# EasyEDA Pro project 01_立创eda专业版_esp32语音助手-自制版_2024-07-09.epro, schematic Schematic2
Create Date: 2024-06-22; Page Name: esp32_mini; Project Name: esp32语音助手-自制版; Schematic Name: Schematic2; Update Date: 2024-06-22; Company: 嘉立创EDA; Page Size: A4; Version: V1.0
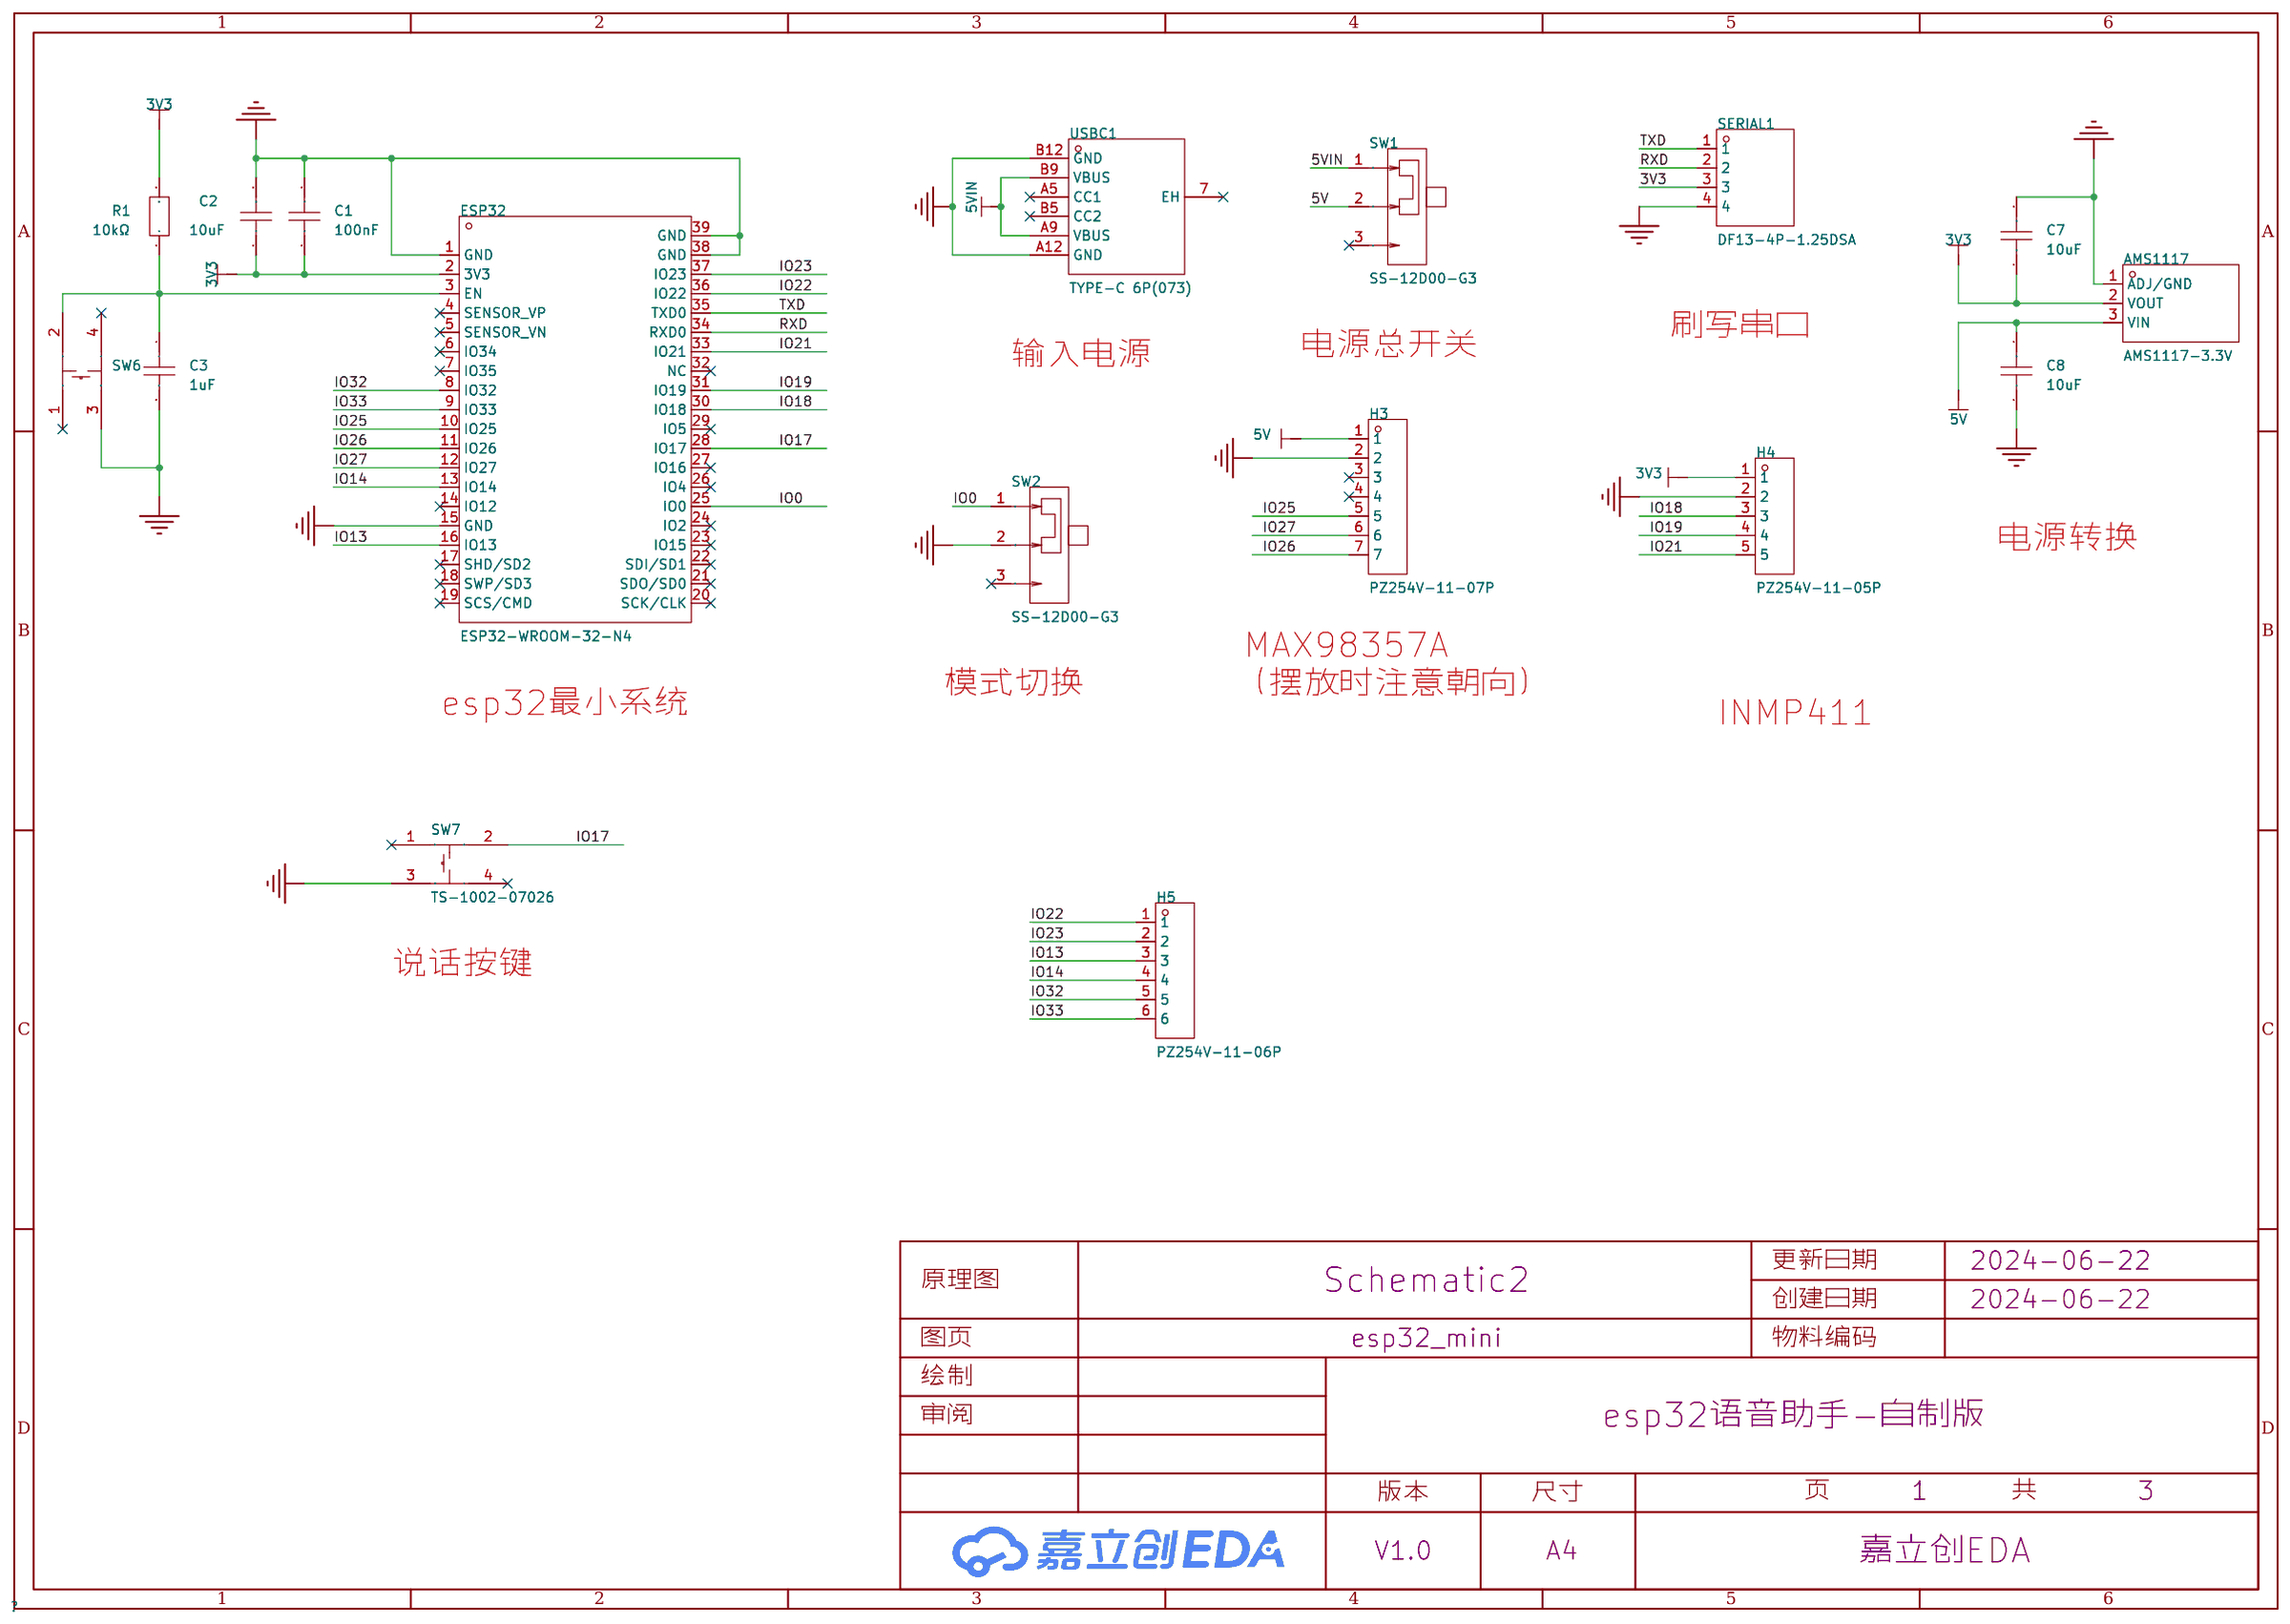
[diagram p9: schematic sheet]

## Parts
AMS1117  AMS1117-3.3V  [SOT-89-3_L4.5-W2.5-P1.50-LS4.2-BR]
C1  100nF  [C0603]
C2  10uF  [C0603]
C3  1uF  [C0603]
C7  10uF  [C0603]
C8  10uF  [C0603]
ESP32  ESP32-WROOM-32-N4  [WIFIM-SMD_ESP32-WROOM-32-N4]
H3  PZ254V-11-07P  [HDR-TH_7P-P2.54-V-M]
H4  PZ254V-11-05P  [HDR-TH_5P-P2.54-V-M]
H5  PZ254V-11-06P  [HDR-TH_6P-P2.54-V-M]
R1  10kΩ  [R0603]
SERIAL1  DF13-4P-1.25DSA  [CONN-TH_DF13-4P-1.25DSA]
SW1  SS-12D00-G3  [SW-TH_SS-12D00-G3]
SW2  SS-12D00-G3  [SW-TH_SS-12D00-G3]
SW6  TS-1002-07026  [SW-TH_4P-L6.0-W6.0-P4.50-LS6.5]
SW7  TS-1002-07026  [SW-TH_4P-L6.0-W6.0-P4.50-LS6.5]
USBC1  TYPE-C 6P(073)  [TYPE-C-SMD_TYPE-C-6P]

## Library data of the parts
AMS1117 = AMS1117-3.3V_C5120796: 输出类型:固定;最大输入电压:18V;输出电压:3.3V;最大输出电流:1A;输出极性:正极;; LCSC Part Name: 输入18V 输出3.3V 1A; Supplier Part: C5120796; Manufacturer: MSKSEMI(美森科); Supplier Footprint: SOT-89; JLCPCB Part Class: 扩展库; Datasheet: https://atta.szlcsc.com/upload/public/pdf/source/20231123/6117526697EB8BF6175FDEEBA0877266.pdf; Supplier: LCSC; Output Type: 固定; Maximum Input Voltage: 18V; Output Voltage: 3.3V; MAX Output Current: 1A; Dropout Voltage: 1.4V@(1A); standby current: 12mA; Operating Temperature: 0℃~+125℃; Output Polarity: 正极; Number of Outputs: 1
C1 = CC0603KRX7R9BB104: 容值:100nF;精度:±10%;额定电压:50V;材质(温度系数):X7R;; LCSC Part Name: 100nF ±10% 50V; Supplier Part: C14663; Manufacturer: YAGEO(国巨); Supplier Footprint: 0603; JLCPCB Part Class: 基础库; Datasheet: https://atta.szlcsc.com/upload/public/pdf/source/20180910/C282072_33301C7F631E79921B82A8DAC6BCC5B3.pdf; Supplier: LCSC; Tolerance: ±10%; Voltage Rated: 50V; Temperature Coefficient: X7R
C2 = CL10A106MA8NRNC: 容值:10uF;精度:±20%;额定电压:25V;材质(温度系数):X5R;; LCSC Part Name: 10uF ±20% 25V; Supplier Part: C96446; Manufacturer: SAMSUNG(三星); Supplier Footprint: 0603; JLCPCB Part Class: 基础库; Datasheet: https://atta.szlcsc.com/upload/public/pdf/source/20160218/1457707763339.pdf; Supplier: LCSC; Tolerance: ±20%; Voltage Rated: 25V; Temperature Coefficient: X5R
C3 = CL10A105KB8NNNC: 容值:1uF;精度:±10%;额定电压:50V;材质(温度系数):X5R;; LCSC Part Name: 1uF ±10% 50V; Supplier Part: C15849; Manufacturer: SAMSUNG(三星); Supplier Footprint: 0603; JLCPCB Part Class: 基础库; Datasheet: https://atta.szlcsc.com/upload/public/pdf/source/20160218/1457707763339.pdf; Supplier: LCSC; Tolerance: ±10%; Voltage Rated: 50V; Temperature Coefficient: X5R
C7 C8 = CL10A106KP8NNNC: 容值:10uF;精度:±10%;额定电压:10V;材质(温度系数):X5R;; LCSC Part Name: 10uF ±10% 10V; Supplier Part: C19702; Manufacturer: SAMSUNG(三星); Supplier Footprint: 0603; JLCPCB Part Class: 基础库; Datasheet: https://atta.szlcsc.com/upload/public/pdf/source/20160218/1457707763339.pdf; Supplier: LCSC; Tolerance: ±10%; Voltage Rated: 10V; Temperature Coefficient: X5R
ESP32 = ESP32-WROOM-32-N4: WiFi+蓝牙4.2+双核CPU,ESP32; LCSC Part Name: WiFi+蓝牙4.2+双核CPU模块; Supplier Part: C82899; Manufacturer: ESPRESSIF(乐鑫); Supplier Footprint: SMD,18x25.5mm; JLCPCB Part Class: 扩展库; Datasheet: https://atta.szlcsc.com/upload/public/pdf/source/20210719/C82899_2D52724B6FAFABC419BCF308C5944296.pdf; Supplier: LCSC
H3 = PZ254V-11-07P: 插针结构:1x7P;间距:2.54mm;行距:-;圆针/方针:方针;安装类型:直插;排数:单排;总PIN位数:7P;额定电流:-;额定电压:-;配合针长度:6mm;塑高:2.5mm;端接针长度:3mm;触头材质:黄铜;触头镀层:-;工作温度范围:-40℃~+105℃;颜色:黑色;; LCSC Part Name: 间距:2.54mm 1x7P 直插 方针; Supplier Part: C492406; Manufacturer: XFCN(兴飞); Supplier Footprint: 插件,P=2.54mm; JLCPCB Part Class: 扩展库; Datasheet: https://atta.szlcsc.com/upload/public/pdf/source/20200309/C492406_654C533EE691117E22DD9F76C114C2D9.pdf; Supplier: LCSC; Pin Structure: 1x7P; Pitch: 2.54mm; Circluar Pins/Square Pins: 方针; Mounting Type: 直插; Number of Rows: 单排; Number of Pins: 7P; Length of Mating Pin: 6mm; Insulation Height: 2.5mm; Length of End Connection Pin: 3mm; Contact Material: 黄铜; Operating Temperature Range: -40℃~+105℃; Color: 黑色
H4 = PZ254V-11-05P: 插针结构:1x5P;间距:2.54mm;行距:-;圆针/方针:方针;安装类型:直插;排数:单排;总PIN位数:5P;额定电流:-;额定电压:-;配合针长度:6mm;塑高:2.5mm;端接针长度:3mm;触头材质:黄铜;触头镀层:-;工作温度范围:-40℃~+105℃;颜色:黑色;; LCSC Part Name: 间距:2.54mm 1x5P 直插 方针; Supplier Part: C492404; Manufacturer: XFCN(兴飞); Supplier Footprint: 插件,P=2.54mm; JLCPCB Part Class: 扩展库; Datasheet: https://atta.szlcsc.com/upload/public/pdf/source/20200309/C492404_E51533260F8710EFF5D4617281164C1D.pdf; Supplier: LCSC; Pin Structure: 1x5P; Pitch: 2.54mm; Circluar Pins/Square Pins: 方针; Mounting Type: 直插; Number of Rows: 单排; Number of Pins: 5P; Length of Mating Pin: 6mm; Insulation Height: 2.5mm; Length of End Connection Pin: 3mm; Contact Material: 黄铜; Operating Temperature Range: -40℃~+105℃; Color: 黑色
H5 = PZ254V-11-06P: 插针结构:1x6P;间距:2.54mm;行距:-;圆针/方针:方针;安装类型:直插;排数:单排;总PIN位数:6P;额定电流:-;额定电压:-;配合针长度:6mm;塑高:2.5mm;端接针长度:3mm;触头材质:黄铜;触头镀层:-;工作温度范围:-40℃~+105℃;颜色:黑色;; LCSC Part Name: 间距:2.54mm 1x6P 直插 方针; Supplier Part: C492405; Manufacturer: XFCN(兴飞); Supplier Footprint: 插件,P=2.54mm; JLCPCB Part Class: 扩展库; Datasheet: https://atta.szlcsc.com/upload/public/pdf/source/20200309/C492405_597F1930F5B55CC3C7FD95458F1C3977.pdf; Supplier: LCSC; Pin Structure: 1x6P; Pitch: 2.54mm; Circluar Pins/Square Pins: 方针; Mounting Type: 直插; Number of Rows: 单排; Number of Pins: 6P; Length of Mating Pin: 6mm; Insulation Height: 2.5mm; Length of End Connection Pin: 3mm; Contact Material: 黄铜; Operating Temperature Range: -40℃~+105℃; Color: 黑色
R1 = FRC0603J103TS: 电阻类型:厚膜电阻;阻值:10kΩ;精度:±5%;功率:100mW;最大工作电压:75V;温度系数:±100ppm/℃;; LCSC Part Name: 10kΩ ±5% 100mW 厚膜电阻; Supplier Part: C2930027; Manufacturer: FOJAN(富捷); Supplier Footprint: 0603; JLCPCB Part Class: 扩展库; Datasheet: https://atta.szlcsc.com/upload/public/pdf/source/20211221/925EC7D7225764EE0046F22065062C87.pdf; Supplier: LCSC; Type: 厚膜电阻; Tolerance: ±5%; Power(Watts): 100mW; Overload Voltage (Max): 75V; Temperature Coefficient: ±100ppm/℃; Operating Temperature Range: -55℃~+155℃
SERIAL1 = DF13-4P-1.25DSA: 插针结构:1x4P;间距:1.25mm;安装方式:-;参考系列:-;总PIN数:4P;排数:1;每排PIN数:4;行距:-;触头材质:黄铜;; LCSC Part Name: 间距:1.25mm 1x4P; Supplier Part: C202091; Manufacturer: HRS(广濑); Supplier Footprint: P=1.25mm; JLCPCB Part Class: 扩展库; Datasheet: https://atta.szlcsc.com/upload/public/pdf/source/20180509/C202091_DB48A71B72F23293CB2FD82E8A62B156.pdf; Supplier: LCSC; Pins Structure: 1x4P; Pitch: 1.25mm; Number of Pins: 4P; Number of Rows: 1; Number of PINs Per Row: 4; Contact Material: 黄铜
SW1 SW2 = SS-12D00-G3: Supplier Part: C22355741; Manufacturer: SOFNG(硕方); Supplier Footprint: 插件-3P,8.8x3.9mm; Datasheet: https://atta.szlcsc.com/upload/public/pdf/source/20240529/1037A069FE9BBCECE56007AB916D4384.pdf; Supplier: LCSC
SW6 SW7 = TS-1002-07026: 电路结构:单刀单掷;按钮形状:圆形按钮;安装方式:直插;开关长度:6mm;开关宽度:6mm;开关高度:7mm;触点电流:50mA;额定电压(DC):12V;带灯:-;机械寿命:-;; LCSC Part Name: 6*6*7mm 直插 轻触开关; Supplier Part: C455095; Manufacturer: XUNPU(讯普); Supplier Footprint: 插件,6x6mm; JLCPCB Part Class: 扩展库; Datasheet: https://atta.szlcsc.com/upload/public/pdf/source/20231108/52BC6409AB52B6746CCC051A15664904.pdf; Supplier: LCSC; Circuit: 单刀单掷; Actuator Style: 圆形按钮; Mounting Style: 直插; Switch Length: 6mm; Switch Width: 6mm; Switch Height: 7mm; Contact Current: 50mA; Voltage Rating (DC): 12V
USBC1 = TYPE-C 6P(073): 连接器类型:Type-C;标准:-;公母:母;端口数量:1;触点数量:6P;安装方式:卧贴;额定电流 - 电源:5A;工作温度范围:-25℃~+85℃;; LCSC Part Name: Type-C 母 卧贴; Supplier Part: C668623; Manufacturer: SHOU HAN(首韩); Supplier Footprint: SMD; JLCPCB Part Class: 扩展库; Datasheet: https://atta.szlcsc.com/upload/public/pdf/source/20200618/C668623_A4B260DED7AC1949BAC6AE39E9F4CD80.pdf; Supplier: LCSC; Connector Type: Type-C; Gender: 母; Number of Ports: 1; Number of Contacts: 6P; Mounting Style: 卧贴; Current Rating - Power (Max): 5A; Operating Temperature Range: -25℃~+85℃

## Nets
3V3: AMS1117.2(VOUT) C1.1 C2.1 C7.1 ESP32.2(3V3) H4.1 R1.2 SERIAL1.3
5V: AMS1117.3(VIN) C8.2 H3.1 SW1.2
5VIN: SW1.1 USBC1.A9(VBUS) USBC1.B9(VBUS)
GND: AMS1117.1(ADJ/GND) C1.2 C2.2 C3.2 C7.2 C8.1 ESP32.1(GND) ESP32.15(GND) ESP32.38(GND) ESP32.39(GND) H3.2 H4.2 SERIAL1.4 SW2.2 SW6.3 SW7.3 USBC1.A12(GND) USBC1.B12(GND)
IO0: ESP32.25(IO0) SW2.1
IO13: ESP32.16(IO13) H5.3
IO14: ESP32.13(IO14) H5.4
IO17: ESP32.28(IO17) SW7.2
IO18: ESP32.30(IO18) H4.3
IO19: ESP32.31(IO19) H4.4
IO21: ESP32.33(IO21) H4.5
IO22: ESP32.36(IO22) H5.1
IO23: ESP32.37(IO23) H5.2
IO25: ESP32.10(IO25) H3.5
IO26: ESP32.11(IO26) H3.7
IO27: ESP32.12(IO27) H3.6
IO32: ESP32.8(IO32) H5.5
IO33: ESP32.9(IO33) H5.6
RXD: ESP32.34(RXD0) SERIAL1.2
TXD: ESP32.35(TXD0) SERIAL1.1
Net-(C3-1): C3.1 ESP32.3(EN) R1.1 SW6.2

Not connected (* = marked no-connect by the designer): ESP32 4(SENSOR_VP)* 5(SENSOR_VN)* 6(IO34)* 7(IO35)* 14(IO12)* 17(SHD/SD2)* 18(SWP/SD3)* 19(SCS/CMD)* 20(SCK/CLK)* 21(SDO/SD0)* 22(SDI/SD1)* 23(IO15)* 24(IO2)* 26(IO4)* 27(IO16)* 29(IO5)* 32(NC)*; H3 3* 4*; SW1 3*; SW2 3*; SW6 1* 4*; SW7 1* 4*; USBC1 7(EH)* A5(CC1)* B5(CC2)*

## Notes on the sheet
- 刷写串口
- 电源总开关
- 输入电源
- 电源转换
- 模式切换
- MAX98357A
  （摆放时注意朝向）
- esp32最小系统
- INMP411
- 说话按键
